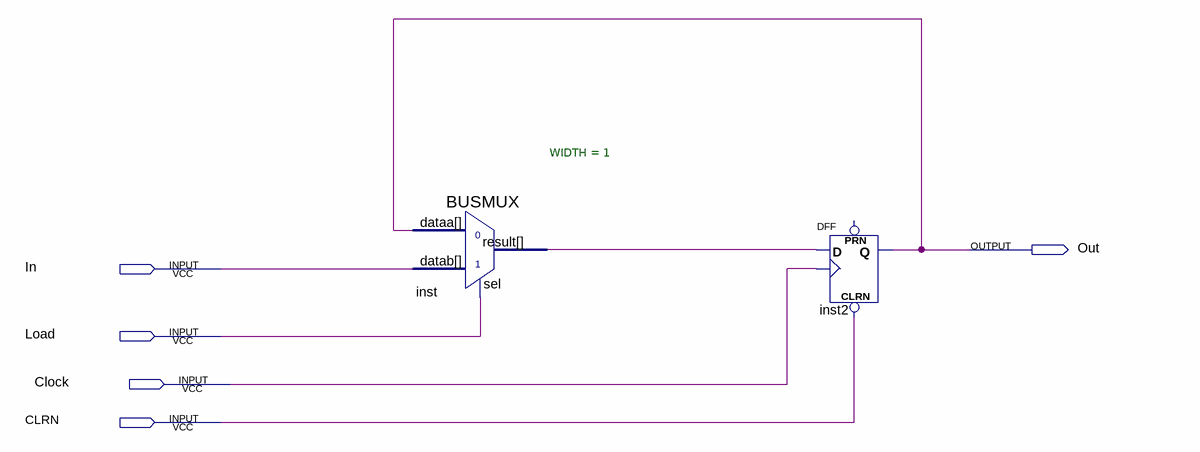
[diagram p0: schematic sheet]
// Quartus schematic register.bdf as structural Verilog: 2 symbols, 5 pins
module register (
  input  In,
  input  Load,
  input  Clock,
  input  CLRN,
  output Out
);

  wire inst_result;

  BUSMUX #(.WIDTH(1)) inst (.datab(In), .sel(Load), .dataa(Out), .result(inst_result));
  DFF inst2 (.CLRN(CLRN), .CLK(Clock), .D(inst_result), .Q(Out));  // open: PRN
endmodule
